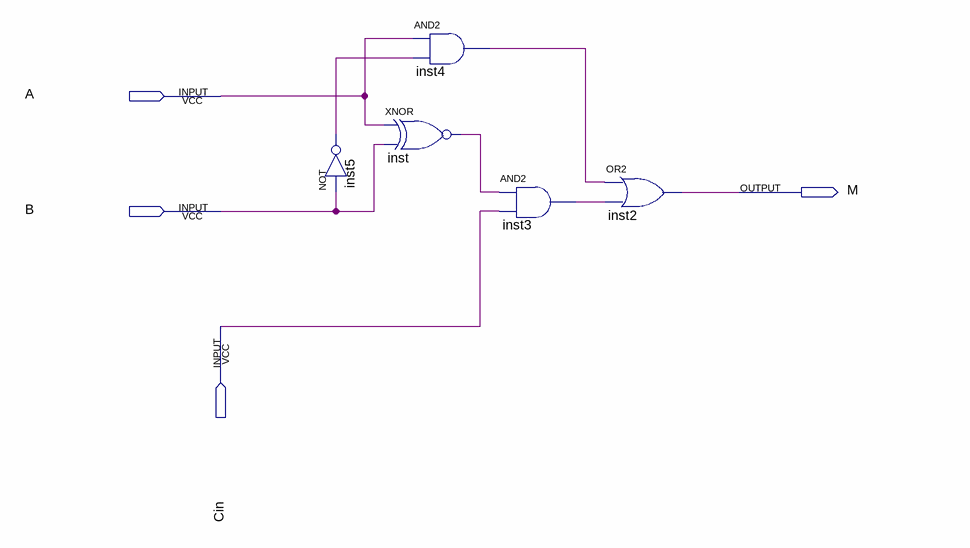
[diagram p0: schematic sheet]
// Quartus schematic Maior-que-1-bit.bdf as structural Verilog: 5 symbols, 4 pins
module \Maior-que-1-bit  (
  input  A,
  input  B,
  input  Cin,
  output M
);

  wire inst3_out, inst4_out, inst5_out, inst_out;

  not inst5 (inst5_out, B);
  and inst4 (inst4_out, A, inst5_out);
  xnor inst (inst_out, A, B);
  and inst3 (inst3_out, inst_out, Cin);
  or inst2 (M, inst4_out, inst3_out);
endmodule
